# Altium schematic sheet Sheet_CL-RB-01.SchDoc: Rectifier bridge
size A4; Author: Canaan Lv; DocumentNumber: CL-RB-01; Revision: v1.0
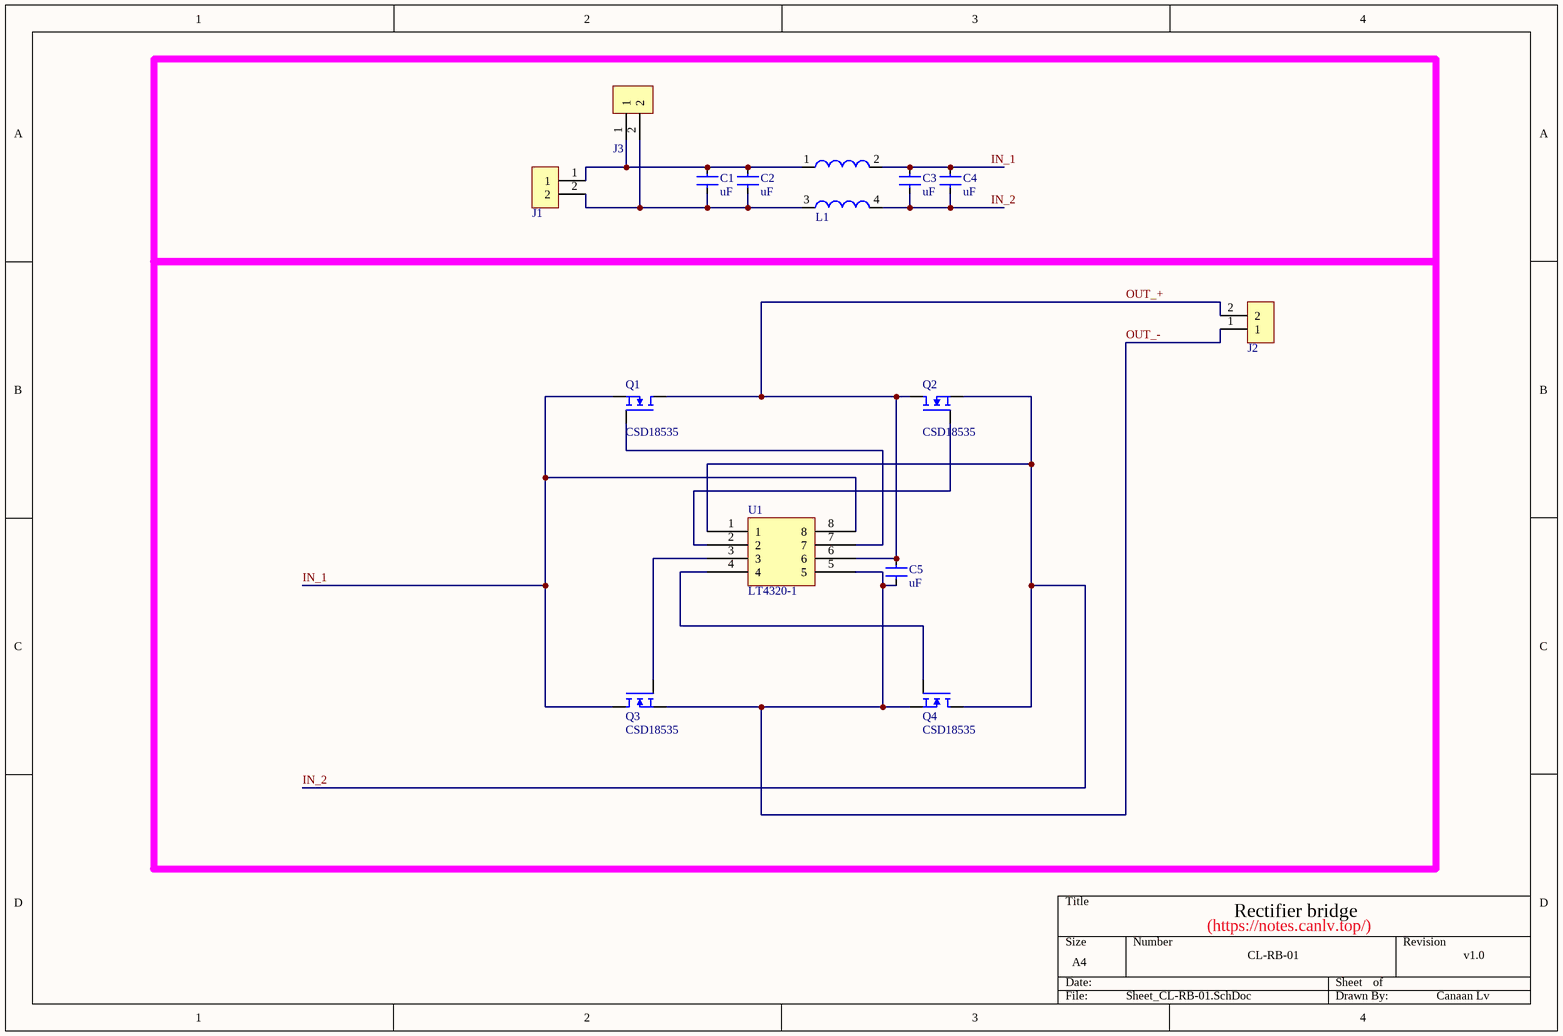
[diagram p0: Sheet_CL-RB-01.SchDoc]

## Parts
C1  uF  [CAP-7.5-CP]
C2  uF  [CAP-15]
C3  uF  [CAP-15]
C4  uF  [CAP-7.5-CP]
C5  uF  [C0.254]
J1  SIP-2  [9.5栅栏式接线端子]  (value not drawn)
J2  SIP-2  [9.5栅栏式接线端子]  (value not drawn)
J3  SIP-2  [2.54XH接插件2P]  (value not drawn)
L1  双电感  [L-CM(25*15*12)]  (value not drawn)
Q1  CSD18535  [TO-263-2]
Q2  CSD18535  [TO-263-2]
Q3  CSD18535  [TO-263-2]
Q4  CSD18535  [TO-263-2]
U1  LT4320-1  [DIP8]

## Nets
IN_1: C3.1 C4.1 L1.2 Q1.3(S) Q3.2(D) U1.8
IN_2: C3.2 C4.2 L1.4 Q2.3(S) Q4.2(D) U1.1
OUT_+: C5.1 J2.2 Q1.2(D) Q2.2(D) U1.6
OUT_-: C5.2 J2.1 Q3.3(S) Q4.3(S) U1.5
NetC1_1: C1.1 C2.1 J1.1 J3.1 L1.1
NetC1_2: C1.2 C2.2 J1.2 J3.2 L1.3
NetQ1_1: Q1.1(G) U1.7
NetQ2_1: Q2.1(G) U1.2
NetQ3_1: Q3.1(G) U1.3
NetQ4_1: Q4.1(G) U1.4

## Notes on the sheet
- (https://notes.canlv.top/)

## Library data of the parts
C1-C5 = C直插无极性
Q1-Q4 = N-MOSFET: N-Channel MOSFET
U1 = IC8